# EAGLE design LTC6803 breakout (EAGLE 7.3.0)
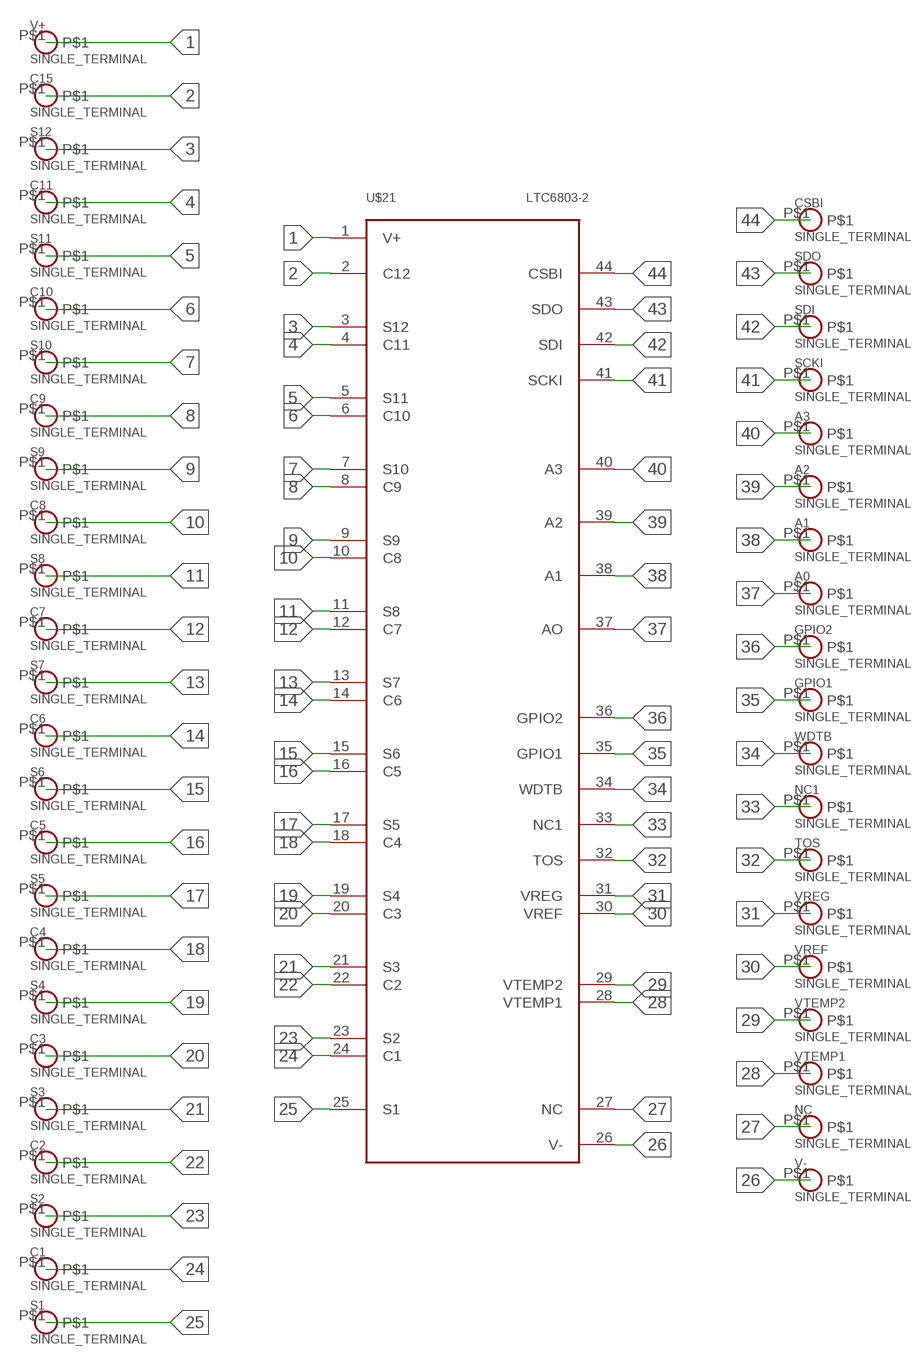
[diagram p0: schematic, sheet 1]

## Parts
A0  SINGLE_TERMINAL  [PLATED_HOLE]
A1  SINGLE_TERMINAL  [PLATED_HOLE]
A2  SINGLE_TERMINAL  [PLATED_HOLE]
A3  SINGLE_TERMINAL  [PLATED_HOLE]
C1  SINGLE_TERMINAL  [PLATED_HOLE]
C2  SINGLE_TERMINAL  [PLATED_HOLE]
C3  SINGLE_TERMINAL  [PLATED_HOLE]
C4  SINGLE_TERMINAL  [PLATED_HOLE]
C5  SINGLE_TERMINAL  [PLATED_HOLE]
C6  SINGLE_TERMINAL  [PLATED_HOLE]
C7  SINGLE_TERMINAL  [PLATED_HOLE]
C8  SINGLE_TERMINAL  [PLATED_HOLE]
C9  SINGLE_TERMINAL  [PLATED_HOLE]
C10  SINGLE_TERMINAL  [PLATED_HOLE]
C11  SINGLE_TERMINAL  [PLATED_HOLE]
C15  SINGLE_TERMINAL  [PLATED_HOLE]
CSBI  SINGLE_TERMINAL  [PLATED_HOLE]
GPIO1  SINGLE_TERMINAL  [PLATED_HOLE]
GPIO2  SINGLE_TERMINAL  [PLATED_HOLE]
NC  SINGLE_TERMINAL  [PLATED_HOLE]
NC1  SINGLE_TERMINAL  [PLATED_HOLE]
S1  SINGLE_TERMINAL  [PLATED_HOLE]
S2  SINGLE_TERMINAL  [PLATED_HOLE]
S3  SINGLE_TERMINAL  [PLATED_HOLE]
S4  SINGLE_TERMINAL  [PLATED_HOLE]
S5  SINGLE_TERMINAL  [PLATED_HOLE]
S6  SINGLE_TERMINAL  [PLATED_HOLE]
S7  SINGLE_TERMINAL  [PLATED_HOLE]
S8  SINGLE_TERMINAL  [PLATED_HOLE]
S9  SINGLE_TERMINAL  [PLATED_HOLE]
S10  SINGLE_TERMINAL  [PLATED_HOLE]
S11  SINGLE_TERMINAL  [PLATED_HOLE]
S12  SINGLE_TERMINAL  [PLATED_HOLE]
SCKI  SINGLE_TERMINAL  [PLATED_HOLE]
SDI  SINGLE_TERMINAL  [PLATED_HOLE]
SDO  SINGLE_TERMINAL  [PLATED_HOLE]
TOS  SINGLE_TERMINAL  [PLATED_HOLE]
U$21  LTC6803-2  [FSOP-44]
V+  SINGLE_TERMINAL  [PLATED_HOLE]
V-  SINGLE_TERMINAL  [PLATED_HOLE]
VREF  SINGLE_TERMINAL  [PLATED_HOLE]
VREG  SINGLE_TERMINAL  [PLATED_HOLE]
VTEMP1  SINGLE_TERMINAL  [PLATED_HOLE]
VTEMP2  SINGLE_TERMINAL  [PLATED_HOLE]
WDTB  SINGLE_TERMINAL  [PLATED_HOLE]

## Nets
1: U$21.1(V+) V+.P$1
2: C15.P$1 U$21.2(C12)
3: S12.P$1 U$21.3(S12)
4: C11.P$1 U$21.4(C11)
5: S11.P$1 U$21.5(S11)
6: C10.P$1 U$21.6(C10)
7: S10.P$1 U$21.7(S10)
8: C9.P$1 U$21.8(C9)
9: S9.P$1 U$21.9(S9)
10: C8.P$1 U$21.10(C8)
11: S8.P$1 U$21.11(S8)
12: C7.P$1 U$21.12(C7)
13: S7.P$1 U$21.13(S7)
14: C6.P$1 U$21.14(C6)
15: S6.P$1 U$21.15(S6)
16: C5.P$1 U$21.16(C5)
17: S5.P$1 U$21.17(S5)
18: C4.P$1 U$21.18(C4)
19: S4.P$1 U$21.19(S4)
20: C3.P$1 U$21.20(C3)
21: S3.P$1 U$21.21(S3)
22: C2.P$1 U$21.22(C2)
23: S2.P$1 U$21.23(S2)
24: C1.P$1 U$21.24(C1)
25: S1.P$1 U$21.25(S1)
26: U$21.26(V-) V-.P$1
27: NC.P$1 U$21.27(NC)
28: U$21.28(VTEMP1) VTEMP1.P$1
29: U$21.29(VTEMP2) VTEMP2.P$1
30: U$21.30(VREF) VREF.P$1
31: U$21.31(VREG) VREG.P$1
32: TOS.P$1 U$21.32(TOS)
33: NC1.P$1 U$21.33(NC1)
34: U$21.34(WDTB) WDTB.P$1
35: GPIO1.P$1 U$21.35(GPIO1)
36: GPIO2.P$1 U$21.36(GPIO2)
37: A0.P$1 U$21.37(AO)
38: A1.P$1 U$21.38(A1)
39: A2.P$1 U$21.39(A2)
40: A3.P$1 U$21.40(A3)
41: SCKI.P$1 U$21.41(SCKI)
42: SDI.P$1 U$21.42(SDI)
43: SDO.P$1 U$21.43(SDO)
44: CSBI.P$1 U$21.44(CSBI)

## Library data of the parts
A0 A1-A3 C1-C11 C15 CSBI GPIO1 GPIO2 NC NC1 S1-S12 SCKI SDI SDO TOS V+ V- VREF VREG VTEMP1 VTEMP2 WDTB = Isaac:SINGLE_TERMINAL; OC_NEWARK: unknown
U$21 = Isaac:LTC6803-2; OC_NEWARK: unknown

## Board
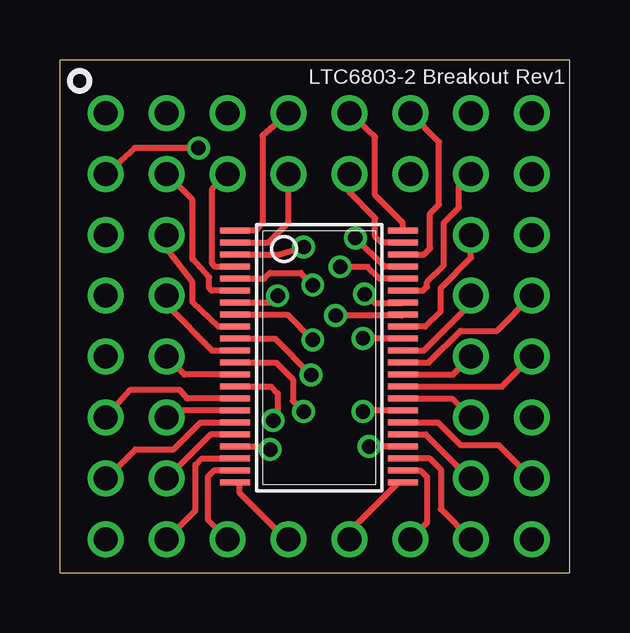
[diagram p1: board, top side]
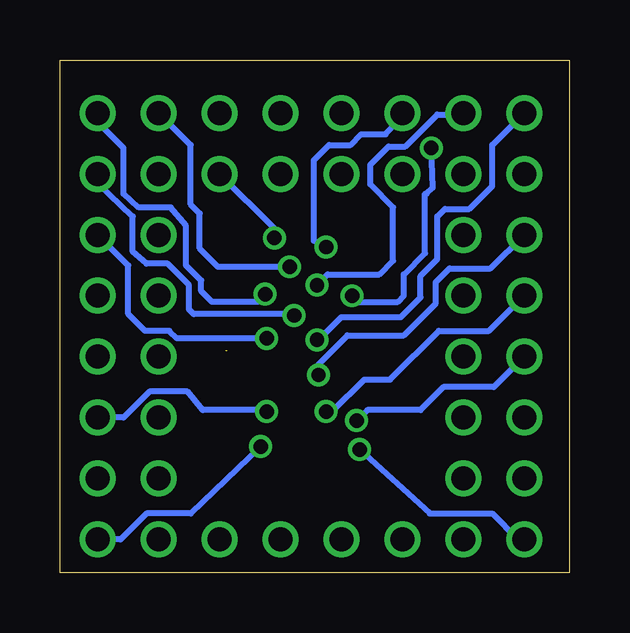
[diagram p2: board, bottom side, seen from below]

Size 21.26 x 21.39 mm. Coordinates in mm from the lower left corner, seen from the top.
Outline: 0,0 21.26,0 21.26,21.39 0,21.39 0,0
Copper layers (1*16): Top 0.0356mm / dielectric 1.5011mm / Bottom 0.0356mm
Design rules "LaenPCBOrder": minimum track width 6mil, minimum drill 13mil, track to track 6mil, track to pad 6mil, pad to pad 6mil, via to via 6mil, smd to smd 6mil, copper to edge 15mil, drill to drill 6mil, minimum pad ring 7mil, minimum via ring 7mil, stop-mask expansion 3mil, vias tented up to drill 0mil, thermal gap 10mil

### Footprints (pad centres in the part's own frame; a part is rotated, then mirrored left to right if it is on the bottom)
PLATED_HOLE = drill 1: P$1 0,0
FSOP-44 = smd 0.25 x 1.25: 1 -5.25,-3.5; 2 -4.75,-3.5; 3 -4.25,-3.5; 4 -3.75,-3.5; 5 -3.25,-3.5; 6 -2.75,-3.5; 7 -2.25,-3.5; 8 -1.75,-3.5; 9 -1.25,-3.5; 10 -0.75,-3.5; 11 -0.25,-3.5; 12 0.25,-3.5; 13 0.75,-3.5; 14 1.25,-3.5; 15 1.75,-3.5; 16 2.25,-3.5; 17 2.75,-3.5; 18 3.25,-3.5; 19 3.75,-3.5; 20 4.25,-3.5; 21 4.75,-3.5; 22 5.25,-3.5; 23 5.25,3.5; 24 4.75,3.5; 25 4.25,3.5; 26 3.75,3.5; 27 3.25,3.5; 28 2.75,3.5; 29 2.25,3.5; 30 1.75,3.5; 31 1.25,3.5; 32 0.75,3.5; 33 0.25,3.5; 34 -0.25,3.5; 35 -0.75,3.5; 36 -1.25,3.5; 37 -1.75,3.5; 38 -2.25,3.5; 39 -2.75,3.5; 40 -3.25,3.5; 41 -3.75,3.5; 42 -4.25,3.5; 43 -4.75,3.5; 44 -5.25,3.5

### Placement (x,y rotation side)
A0  19.68,16.64 0 top
A1  19.68,19.18 0 top
A2  17.14,16.64 0 top
A3  17.14,19.18 0 top
C1  14.61,1.4 0 top
C2  9.53,1.4 0 top
C3  4.44,1.4 0 top
C4  4.44,3.94 0 top
C5  4.44,6.48 0 top
C6  1.9,9.02 0 top
C7  1.9,11.56 0 top
C8  1.9,14.1 0 top
C9  1.9,19.18 0 top
C10  4.44,16.64 0 top
C11  6.98,16.64 0 top
C15  9.53,16.64 0 top
CSBI  12.07,19.18 0 top
GPIO1  19.68,14.1 0 top
GPIO2  17.14,14.1 0 top
NC  17.14,3.94 0 top
NC1  19.68,11.56 0 top
S1  17.14,1.4 0 top
S2  12.07,1.4 0 top
S3  6.98,1.4 0 top
S4  1.9,1.4 0 top
S5  1.9,3.94 0 top
S6  1.9,6.48 0 top
S7  4.44,9.02 0 top
S8  4.44,11.56 0 top
S9  4.44,14.1 0 top
S10  1.9,16.64 0 top
S11  4.44,19.18 0 top
S12  6.98,19.18 0 top
SCKI  14.61,16.64 0 top
SDI  14.61,19.18 0 top
SDO  12.07,16.64 0 top
TOS  17.14,9.02 0 top
U$21  10.79,9.02 270 top
V+  9.53,19.18 0 top
V-  19.68,1.4 0 top
VREF  17.14,6.48 0 top
VREG  19.68,9.02 0 top
VTEMP1  19.68,3.94 0 top
VTEMP2  19.68,6.48 0 top
WDTB  17.14,11.56 0 top

### Tracks (layer width: path | path; a pad name or v marks a point on that pad's centre or on a via)
1
  Top 0.254: V+.P$1 8.45,18.22 8.45,14.6 8.17,14.27 U$21.1
2
  Top 0.254: U$21.2 7.31,13.78 8.7,13.78 9.52,14.6 C15.P$1
3  (via drill 0.6)
  Top 0.254: U$21.3 9.14,13.27 v10.16,13.59
  Bottom 0.254: v10.16,13.59 10.67,13.84 10.67,17.21 10.03,17.84 9.14,17.84 8.7,18.29 7.68,18.29 6.98,18.99 S12.P$1
4
  Top 0.254: U$21.4 6.48,12.76 6.35,12.89 6.35,16 C11.P$1
5  (via drill 0.6)
  Top 0.254: U$21.5 8.52,12.27 8.76,12.51 10.03,12.51 v10.54,12
  Bottom 0.254: v10.54,12 10.1,12.45 7.94,12.45 7.37,13.02 7.37,15.24 8.32,16.19 8.32,17.02 7.56,17.78 6.86,17.78 5.52,19.11 4.51,19.11 S11.P$1
6
  Top 0.254: U$21.6 6.33,11.77 6.22,11.87 6.22,12.32 5.52,13.08 5.52,15.56 C10.P$1
7  (via drill 0.6)
  Top 0.254: U$21.7 8.79,11.27 v9.08,11.56 | v5.78,17.72 3.11,17.72 S10.P$1
  Bottom 0.254: v9.08,11.56 8.83,11.3 7.18,11.3 6.92,11.56 6.92,12.45 6.03,13.34 6.03,15.81 5.97,15.81 5.72,16.07 v5.78,17.72
8  (via drill 0.6)
  Top 0.254: U$21.8 9.49,10.77 v10.54,9.72
  Bottom 0.254: v10.54,9.72 10.48,9.72 9.52,10.67 7.05,10.67 6.22,11.49 6.22,12.38 5.52,13.08 5.52,14.86 5.21,15.18 4.19,15.18 3.24,16.13 3.24,17.84 C9.P$1
9
  Top 0.254: S9.P$1 4.44,13.53 5.52,12.13 5.52,11.3 6.62,10.27 U$21.9
10  (via drill 0.6)
  Top 0.254: U$21.10 8.97,9.77 v10.48,8.26
  Bottom 0.254: v10.48,8.26 10.48,8.7 9.27,9.91 6.92,9.91 5.59,11.24 5.59,12.13 5.02,12.7 3.3,12.7 C8.P$1
11
  Top 0.254: U$21.11 7.26,9.27 6.35,9.27 4.52,11.1 4.52,11.56 S8.P$1
12  (via drill 0.6)
  Top 0.254: U$21.12 9.01,8.77 9.72,8.06 9.72,7.18 v10.16,6.73
  Bottom 0.254: v10.16,6.73 9.91,6.73 8.57,8.06 7.49,8.06 5.46,10.1 3.37,10.1 C7.P$1
13
  Top 0.254: U$21.13 5.19,8.27 S7.P$1
14  (via drill 0.6)
  Top 0.254: U$21.14 8.81,7.77 9.08,7.49 9.08,6.54 v8.89,6.35
  Bottom 0.254: C6.P$1 3.18,7.75 5.27,7.75 6.22,6.79 8.45,6.79 v8.89,6.35
15
  Top 0.254: U$21.15 5.31,7.27 5.02,7.62 2.92,7.62 S6.P$1
16
  Top 0.254: U$21.16 4.73,6.77 C5.P$1
17
  Top 0.254: S5.P$1 2.01,4.01 3.15,5.16 4.75,5.16 5.86,6.27 U$21.17
18
  Top 0.254: U$21.18 6.27,5.77 C4.P$1
19  (via drill 0.6)
  Top 0.254: U$21.19 8.64,5.27 v8.76,5.14
  Bottom 0.254: v8.76,5.14 5.84,2.48 3.24,2.48 2.16,1.4 S4.P$1
20
  Top 0.254: C3.P$1 5.65,2.6 5.65,4.51 5.91,4.77 U$21.20
21
  Top 0.254: U$21.21 6.43,4.27 6.16,4 6.16,2.22 S3.P$1
22
  Top 0.254: U$21.22 7.49,3.72 7.49,3.33 9.32,1.5 C2.P$1
23
  Top 0.254: S2.P$1 12.07,1.73 14.12,3.78 U$21.23
24
  Top 0.254: U$21.24 15.04,4.27 15.3,4 15.3,2.1 C1.P$1
25
  Top 0.254: S1.P$1 15.87,2.67 15.87,4.32 15.43,4.77 U$21.25
26  (via drill 0.6)
  Top 0.254: U$21.26 v12.89,5.27
  Bottom 0.254: v12.89,5.27 15.81,2.48 17.65,2.48 18.73,1.4 V-.P$1
27
  Top 0.254: U$21.27 14.31,5.78 15.24,5.78 17.08,3.94 NC.P$1
28
  Top 0.254: U$21.28 15.77,6.27 16.7,5.33 18.29,5.33 VTEMP1.P$1
29  (via drill 0.6)
  Top 0.254: U$21.29 12.93,6.77 v12.64,6.73
  Bottom 0.254: v12.64,6.73 12.95,6.79 15.3,6.79 15.94,7.56 17.53,7.56 18.61,6.48 VTEMP2.P$1
30
  Top 0.254: U$21.30 16.36,7.27 VREF.P$1
31
  Top 0.254: U$21.31 18.43,7.77 VREG.P$1
32
  Top 0.254: U$21.32 16.4,8.27 TOS.P$1
33
  Top 0.254: U$21.33 15.37,8.77 16.7,10.1 18.22,10.1 NC1.P$1
34  (1 unrouted)
  Top 0.254: 14.35,9.27 15.18,9.27 17.15,11.24 WDTB.P$1
35  (via drill 0.6)
  Top 0.254: U$21.35 12.65,9.77 v12.64,9.78
  Bottom 0.254: v12.64,9.78 16.38,9.78 16.7,10.1 17.72,10.1 18.42,10.79 18.42,12.83 GPIO1.P$1
36
  Top 0.254: GPIO2.P$1 17.15,13.14 15.87,11.87 15.87,10.92 15.22,10.27 U$21.36
37  (via drill 0.6)
  Top 0.254: U$21.37 14.26,10.73 v11.49,10.73
  Bottom 0.254: v11.49,10.73 11.94,10.79 15.68,10.79 15.87,10.99 15.87,12 16.76,12.89 17.65,12.89 18.22,13.4 18.22,14.86 19.68,16.26 A0.P$1
38  (via drill 0.6)
  Top 0.254: U$21.38 14.27,11.24 13.14,11.24 12.76,11.62 v12.7,11.62
  Bottom 0.254: v12.7,11.62 13.02,11.3 14.92,11.3 15.37,11.75 15.37,12.19 16,12.83 16,14.48 16.64,15.24 17.97,15.24 18.61,15.81 18.61,17.72 19.68,18.8 A1.P$1
39
  Top 0.254: U$21.39 15.13,11.77 15.3,11.94 15.3,12.13 16,12.83 16,14.6 16.64,15.24 16.64,16.13 A2.P$1
40  (via drill 0.6)
  Top 0.254: U$21.40 13.32,12.27 12.83,12.76 v11.68,12.76
  Bottom 0.254: v11.68,12.76 14.67,12.76 15.43,13.53 15.43,14.99 15.81,15.37 15.81,17.84 A3.P$1
41  (via drill 0.6)
  Top 0.254: U$21.41 13.52,12.77 v12.32,13.97
  Bottom 0.254: v12.32,13.97 12.32,14.35 SCKI.P$1
42
  Top 0.254: U$21.42 15.17,13.27 15.43,13.53 15.43,14.99 15.81,15.37 15.81,17.97 SDI.P$1
43
  Top 0.254: U$21.43 14.28,13.78 13.4,13.78 13.14,14.03 13.14,14.8 12.07,15.87 SDO.P$1
44
  Top 0.254: CSBI.P$1 13.14,18.16 13.14,15.75 14.29,14.6 U$21.44

### Text on the board
tNames: LTC6803-2 Breakout Rev1